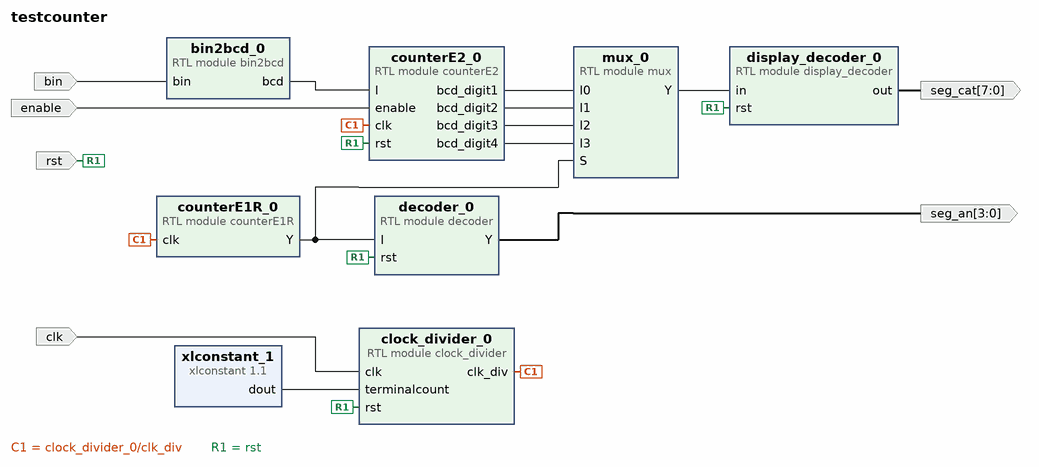
[diagram p0: block diagram of the top level]
# Vivado block design testcounter, xc7z007sclg400-1, Vivado 2024.1.1
create_bd_design testcounter

create_bd_port -dir O -from 7 -to 0 seg_cat
create_bd_port -dir O -from 3 -to 0 seg_an
create_bd_port -dir I enable
create_bd_port -dir I clk
create_bd_port -dir I rst
create_bd_port -dir I bin

create_bd_cell -type module -reference counterE2 counterE2_0
create_bd_cell -type module -reference mux mux_0
create_bd_cell -type module -reference display_decoder display_decoder_0
create_bd_cell -type module -reference decoder decoder_0
create_bd_cell -type module -reference counterE1R counterE1R_0
create_bd_cell -type module -reference clock_divider clock_divider_0
create_bd_cell -type ip -vlnv xilinx.com:ip:xlconstant:1.1 xlconstant_1
set_property -dict {CONFIG.CONST_VAL 49999 CONFIG.CONST_WIDTH 17} [get_bd_cells xlconstant_1]
create_bd_cell -type module -reference bin2bcd bin2bcd_0

# ---- connections ----

connect_bd_net [get_bd_pins bin2bcd_0/bcd] [get_bd_pins counterE2_0/I]
connect_bd_net [get_bd_ports bin] [get_bd_pins bin2bcd_0/bin]
connect_bd_net [get_bd_ports clk] [get_bd_pins clock_divider_0/clk]
connect_bd_net [get_bd_pins clock_divider_0/clk_div] [get_bd_pins counterE1R_0/clk] [get_bd_pins counterE2_0/clk]
connect_bd_net [get_bd_pins counterE1R_0/Y] [get_bd_pins decoder_0/I] [get_bd_pins mux_0/S]
connect_bd_net [get_bd_pins counterE2_0/bcd_digit1] [get_bd_pins mux_0/I0]
connect_bd_net [get_bd_pins counterE2_0/bcd_digit2] [get_bd_pins mux_0/I1]
connect_bd_net [get_bd_pins counterE2_0/bcd_digit3] [get_bd_pins mux_0/I2]
connect_bd_net [get_bd_pins counterE2_0/bcd_digit4] [get_bd_pins mux_0/I3]
connect_bd_net [get_bd_pins decoder_0/Y] [get_bd_ports seg_an]
connect_bd_net [get_bd_pins display_decoder_0/out] [get_bd_ports seg_cat]
connect_bd_net [get_bd_ports enable] [get_bd_pins counterE2_0/enable]
connect_bd_net [get_bd_pins mux_0/Y] [get_bd_pins display_decoder_0/in]
connect_bd_net [get_bd_ports rst] \
  [get_bd_pins decoder_0/rst] [get_bd_pins display_decoder_0/rst] [get_bd_pins clock_divider_0/rst] \
  [get_bd_pins counterE2_0/rst]
connect_bd_net [get_bd_pins xlconstant_1/dout] [get_bd_pins clock_divider_0/terminalcount]

validate_bd_design
save_bd_design
